# Altium project ads8688-module.PrjPcb
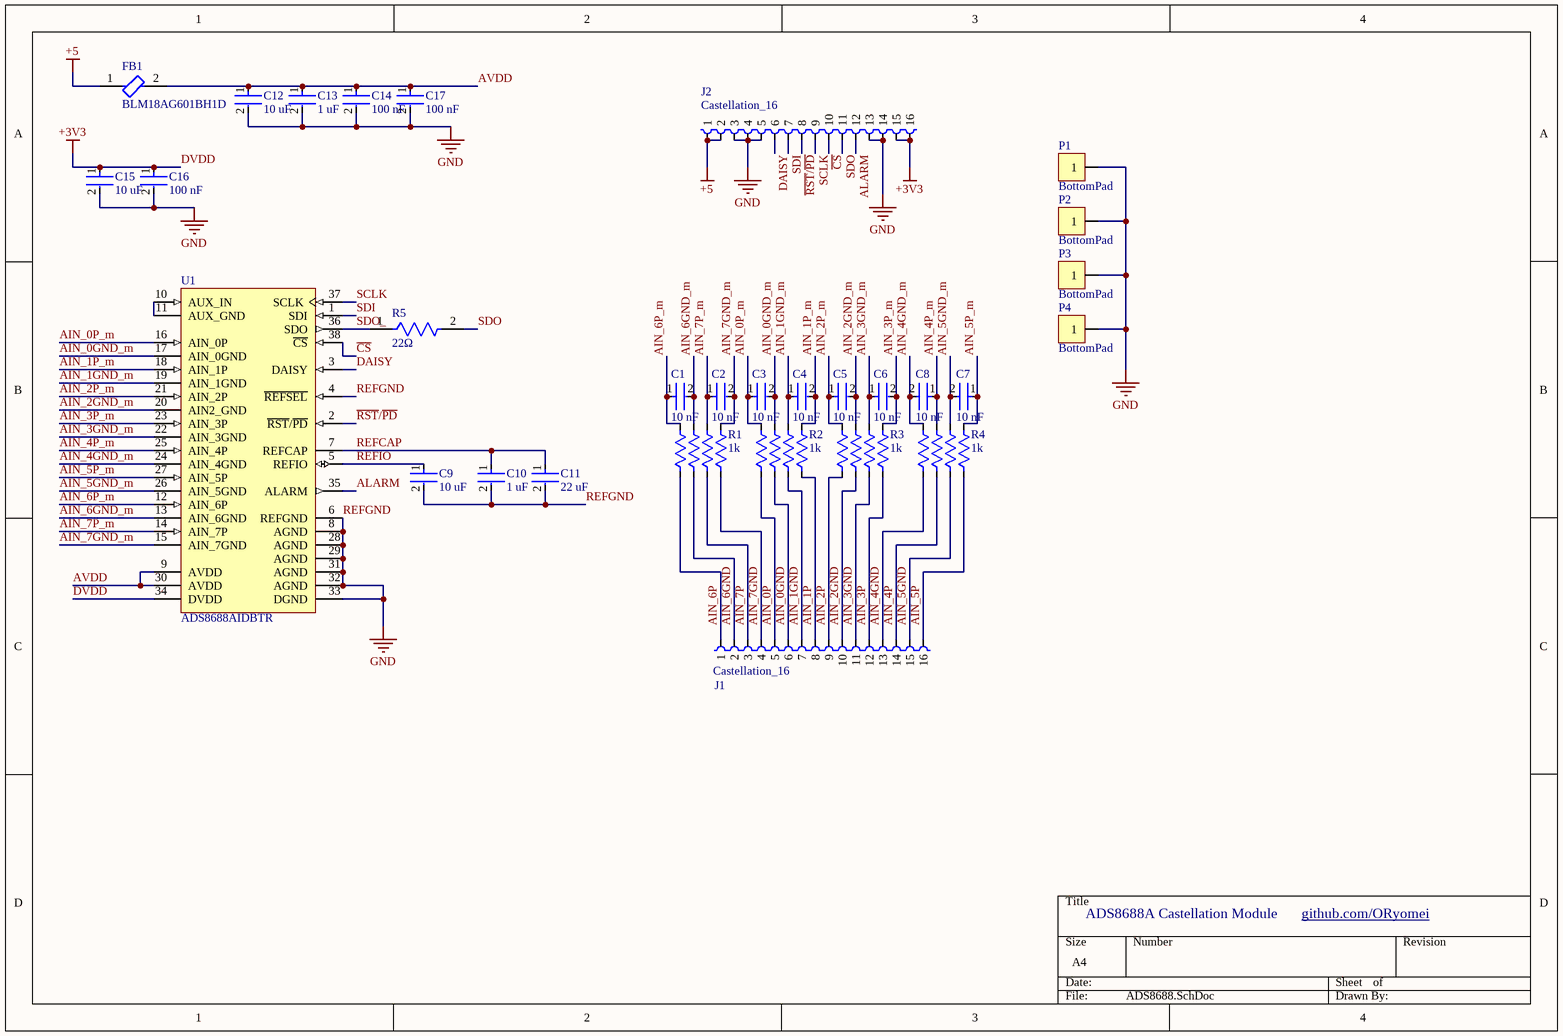
[diagram p0: ADS8688.SchDoc]
1 sheet, 30 parts. Net scope: global (net labels, ports and power ports of the same name join across sheets).
Board file: ADS8688.PcbDoc

## Sheet ADS8688.SchDoc
size A4; SheetNumber: 1; SheetTotal: 1

### Parts
C1  10 nF  [FP-GRT188-0_1-e0_2_0_5-IPC_C]
C2  10 nF  [FP-GRT188-0_1-e0_2_0_5-IPC_C]
C3  10 nF  [FP-GRT188-0_1-e0_2_0_5-IPC_C]
C4  10 nF  [FP-GRT188-0_1-e0_2_0_5-IPC_C]
C5  10 nF  [FP-GRT188-0_1-e0_2_0_5-IPC_C]
C6  10 nF  [FP-GRT188-0_1-e0_2_0_5-IPC_C]
C7  10 nF  [FP-GRT188-0_1-e0_2_0_5-IPC_C]
C8  10 nF  [FP-GRT188-0_1-e0_2_0_5-IPC_C]
C9  10 uF  [FP-GRT188-0_2-MFG]
C10  1 uF  [FP-GRT188-0_1-e0_2_0_5-IPC_C]
C11  22 uF  [FP-GRT21B-0_2-IPC_C]
C12  10 uF  [FP-GRT188-0_2-MFG]
C13  1 uF  [FP-GRT188-0_1-e0_2_0_5-IPC_C]
C14  100 nF  [FP-GCM188-0_1-IPC_B]
C15  10 uF  [FP-GRT188-0_2-MFG]
C16  100 nF  [FP-GCM188-0_1-IPC_B]
C17  100 nF  [FP-GCM188-0_1-IPC_B]
FB1  BLM18AG601BH1D  [FP-BLM18-0_15-t0_8-IPC_B]
J1  Castellation_16  [Castellation_16_hole]  (no BOM)
J2  Castellation_16  [Castellation_16_hole]  (no BOM)
P1  BottomPad  [BottomPad]  (no BOM)
P2  BottomPad  [BottomPad]  (no BOM)
P3  BottomPad  [BottomPad]  (no BOM)
P4  BottomPad  [BottomPad]  (no BOM)
R1  1k  [CAY16A-1001F4LF]
R2  1k  [CAY16A-1001F4LF]
R3  1k  [CAY16A-1001F4LF]
R4  1k  [CAY16A-1001F4LF]
R5  22Ω  [FP-AC0603-IPC_B]
U1  ADS8688AIDBTR  [DBT38_N]

### Nets
+5: FB1.1 J2.1 J2.2
DVDD: C15.1 C16.1 J2.15 J2.16 U1.34(DVDD)  [also labelled +3V3]
REFGND: C9.2 C10.2 C11.2 C12.2 C13.2 C14.2 C15.2 C16.2 C17.2 J2.3 J2.4 J2.5 J2.13 J2.14 P1.1 P2.1 P3.1 P4.1 U1.4(~{REFSEL}) U1.6(REFGND) U1.8(AGND) U1.28(AGND) U1.29(AGND) U1.31(AGND) U1.32(AGND) U1.33(DGND)  [also labelled GND]
AIN_0GND: J1.6 R2.6
AIN_0GND_m: C3.2 R2.3 U1.17(AIN_0GND)
AIN_0P: J1.5 R2.5
AIN_0P_m: C3.1 R2.4 U1.16(AIN_0P)
AIN_1GND: J1.7 R2.7
AIN_1GND_m: C4.1 R2.2 U1.19(AIN_1GND)
AIN_1P: J1.8 R2.8
AIN_1P_m: C4.2 R2.1 U1.18(AIN_1P)
AIN_2GND: J1.10 R3.6
AIN_2GND_m: C5.2 R3.3 U1.20(AIN2_GND)
AIN_2P: J1.9 R3.5
AIN_2P_m: C5.1 R3.4 U1.21(AIN_2P)
AIN_3GND: J1.11 R3.7
AIN_3GND_m: C6.1 R3.2 U1.22(AIN_3GND)
AIN_3P: J1.12 R3.8
AIN_3P_m: C6.2 R3.1 U1.23(AIN_3P)
AIN_4GND: J1.13 R4.5
AIN_4GND_m: C8.2 R4.4 U1.24(AIN_4GND)
AIN_4P: J1.14 R4.6
AIN_4P_m: C8.1 R4.3 U1.25(AIN_4P)
AIN_5GND: J1.15 R4.7
AIN_5GND_m: C7.2 R4.2 U1.26(AIN_5GND)
AIN_5P: J1.16 R4.8
AIN_5P_m: C7.1 R4.1 U1.27(AIN_5P)
AIN_6GND: J1.2 R1.2
AIN_6GND_m: C1.2 R1.7 U1.13(AIN_6GND)
AIN_6P: J1.1 R1.1
AIN_6P_m: C1.1 R1.8 U1.12(AIN_6P)
AIN_7GND: J1.4 R1.4
AIN_7GND_m: C2.2 R1.5 U1.15(AIN_7GND)
AIN_7P: J1.3 R1.3
AIN_7P_m: C2.1 R1.6 U1.14(AIN_7P)
ALARM: J2.12 U1.35(ALARM)
AVDD: C12.1 C13.1 C14.1 C17.1 FB1.2 U1.9(AVDD) U1.30(AVDD)
~{CS}: J2.10 U1.38(~{CS})
DAISY: J2.6 U1.3(DAISY)
~{RST}/~{PD}: J2.8 U1.2(~{RST}/~{PD})
REFCAP: C10.1 C11.1 U1.7(REFCAP)
REFIO: C9.1 U1.5(REFIO)
SCLK: J2.9 U1.37(SCLK)
SDI: J2.7 U1.1(SDI)
SDO: J2.11 R5.2
SDO_: R5.1 U1.36(SDO)
NetU1_10: U1.10(AUX_IN) U1.11(AUX_GND)

### Notes on the sheet
- ADS8688A Castellation Module
- github.com/ORyomei <https://github.com/ORyomei>

### Library data of the parts
C1-C8 = CMP-06035-024823-1: Multi-Layer Ceramic Capacitor 10nF 25V C0G ±1% 0603 Paper T/R / GRT1885C1E103FA02D / 0603
C9 C12 C15 = CMP-06035-032378-1: Multi-Layer Ceramic Capacitor 10uF 25V X5R ±20% 0603 Paper T/R / GRT188R61E106ME13D / 10 uF; Thickness: 0.035inch; Case/Package: 0603; Capacitance: 10uF; Voltage Rating: 25V; Mount: Surface Mount; Packaging: Tape and Reel; Width: 0.031inch; Max Operating Temperature: 85°C; Case Code (Imperial): 0603; Ratings: AEC-Q200; Tolerance: 20%; Min Operating Temperature: -55°C; Case Code (Metric): 1608; Length: 0.063inch
C10 C13 = CMP-06035-050353-1: Multi-Layer Ceramic Capacitor 1uF 25V X7R ±10% 0603 Paper T/R / GRT188R71E105KE13D / 1 uF
C11 = CMP-06035-011672-1: Multi-Layer Ceramic Capacitor 22uF 25V X5R ±20% 0805 Emboss T/R / GRT21BR61E226ME13L / 22 uF; Mount: Surface Mount; Case/Package: 0805; Min Operating Temperature: -55°C; Thickness: 0.057inch; Max Operating Temperature: 85°C; Case Code (Imperial): 0805; Voltage Rating: 25V; Length: 0.079inch; Ratings: AEC-Q200; Case Code (Metric): 2012; Capacitance: 22uF; Width: 0.049inch; Packaging: Tape and Reel; Tolerance: 20%
C14 C16 C17 = CMP-06035-005116-1: Ceramic Capacitor for Automotive 100nF  ±20% 25VDC X8R 0603 Paper T/R / GCM188R91E104MA37J / 100 nF
FB1 = CMP-06046-002494-1: Chip Ferrite Bead, 0603, 600Ω @ 100MHz, 0.38Ω, 25%, 500mA; DC Resistance (DCR): 380mR; Number of Lines: 1; Ratings: AEC-Q200; Case Code (Imperial): 0603; Max Operating Temperature: 150°C; Case Code (Metric): 1608; RoHS Compliant: Yes; Min Operating Temperature: -55°C; Max Current Rating: 500mA; Case/Package: 0603
J1 J2 = Castellation_16: 8 holes
R1-R4 = CAY16A-1001F4LF
R5 = CMP-03412-040387-1: RES 22Ω 5.00% 0.1W 0603 / AC0603JR-0722RL; Resistance: 22R; Power Rating: 100mW; Temperature Coefficient: 100ppm/°C; Voltage Rating: 50V; Tolerance: 5%; Series: AC; Width: 0.8mm; Termination: SMD/SMT; Case/Package: 0603; Min Operating Temperature: -55°C; Resistor Type: Thick Film; Number of Terminations: 2; Ratings: AEC-Q200; Features: Moisture Resistant; Length: 1.6mm; Packaging: Tape and Reel; Max Power Dissipation: 100mW; Case Code (Imperial): 0603; Height: 0.45mm; Max Operating Temperature: 155°C; Case Code (Metric): 1608
U1 = ADS8688AIDBTR: Single-Supply, SAR ADCs with Bipolar Input Ranges, 16 Bits, 500 kSPS, 8 Channel, -40 to 125 degC, 38-Pin TSSOP (DBT), Green (RoHS & no Sb/Br), Tape and Reel; Manufacturer: Texas Instruments; PartNumber: ADS8688IDBTR; THD: -102 dB; SNR: 92 dB; AVDD: 4.75 to 5.25 V; Input Channel: 8; Resolution: 16 Bits; Eco-Plan: Green (RoHS & no Sb/Br); Temperature Range: -40 to 125 degC; Mounting Technology: Surface Mount; DatasheetVersion: SBAS582B; Packing: Tape and Reel; PackageVersion: 4073252-6/I; Sample Rate: 500 kSPS; ComponentLink2Description: Datasheet; ComponentLink3Description: Package Specification; ComponentLink3URL: http://www.ti.com/lit/ml/mpds368/mpds368.pdf; ComponentLink1Description: Manufacturer URL; ComponentLink2URL: http://www.ti.com/lit/ds/symlink/ads8688.pdf; PackageDescription: 38-Pin Plastic Small Outline Package, Body 9.7 x 4.4 mm, Pitch 0.5 mm; ComponentLink1URL: www.ti.com; Supplier 1: DigiKey; Supplier Part Number 1: 296-ADS8688AIDBTRDKR-ND